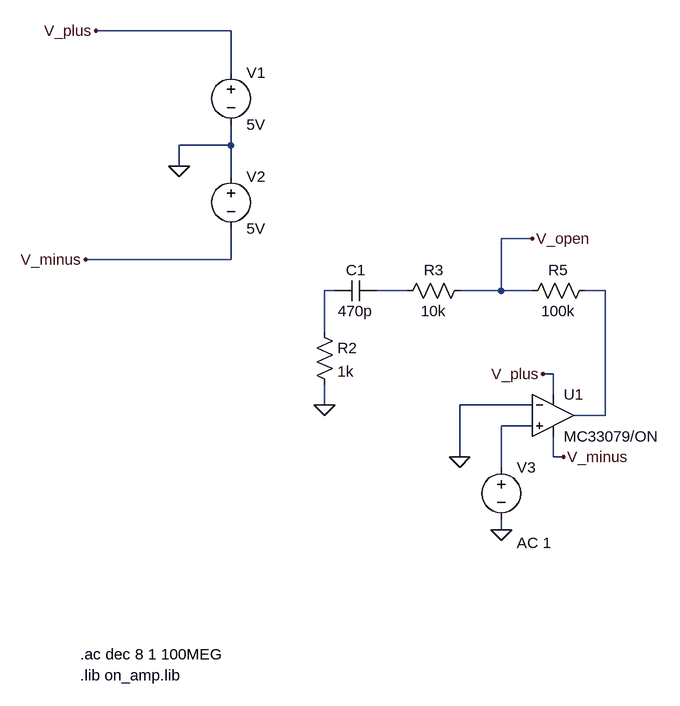
[diagram p0: schematic openloop_gain.asc]
openloop_gain.asc, the LTspice schematic file:
Version 4
SHEET 1 920 840
WIRE -1024 -448 -1232 -448
WIRE -1024 -384 -1024 -448
WIRE -1024 -272 -1024 -304
WIRE -1024 -272 -1104 -272
WIRE -1104 -240 -1104 -272
WIRE -1024 -224 -1024 -272
WIRE -560 -128 -608 -128
WIRE -1024 -96 -1024 -144
WIRE -1024 -96 -1248 -96
WIRE -864 -48 -880 -48
WIRE -752 -48 -800 -48
WIRE -608 -48 -608 -128
WIRE -608 -48 -672 -48
WIRE -560 -48 -608 -48
WIRE -448 -48 -480 -48
WIRE -880 16 -880 -48
WIRE -528 80 -544 80
WIRE -528 112 -528 80
WIRE -880 128 -880 96
WIRE -560 128 -672 128
WIRE -448 144 -448 -48
WIRE -448 144 -496 144
WIRE -560 160 -608 160
WIRE -672 208 -672 128
WIRE -528 208 -528 176
WIRE -512 208 -528 208
WIRE -608 224 -608 160
WIRE -608 320 -608 304
FLAG -1104 -240 0
FLAG -1232 -448 V_plus
FLAG -1248 -96 V_minus
FLAG -512 208 V_minus
FLAG -544 80 V_plus
FLAG -608 320 0
FLAG -672 208 0
FLAG -880 128 0
FLAG -560 -128 V_open
SYMBOL Opamps\\opamp2 -528 80 R0
SYMATTR InstName U1
SYMATTR Value MC33079/ON
SYMBOL voltage -1024 -400 R0
WINDOW 123 0 0 Left 0
WINDOW 39 0 0 Left 0
SYMATTR InstName V1
SYMATTR Value 5V
SYMBOL voltage -1024 -240 R0
WINDOW 123 0 0 Left 0
WINDOW 39 0 0 Left 0
SYMATTR InstName V2
SYMATTR Value 5V
SYMBOL voltage -608 208 R0
WINDOW 123 24 132 Left 0
WINDOW 39 0 0 Left 0
SYMATTR Value2 AC 1
SYMATTR InstName V3
SYMATTR Value ""
SYMBOL res -896 0 R0
SYMATTR InstName R2
SYMATTR Value 1k
SYMBOL cap -800 -64 R90
WINDOW 0 0 32 VBottom 0
WINDOW 3 32 32 VTop 0
SYMATTR InstName C1
SYMATTR Value 470p
SYMBOL res -656 -64 R90
WINDOW 0 0 56 VBottom 0
WINDOW 3 32 56 VTop 0
SYMATTR InstName R3
SYMATTR Value 10k
SYMBOL res -464 -64 R90
WINDOW 0 0 56 VBottom 0
WINDOW 3 32 56 VTop 0
SYMATTR InstName R5
SYMATTR Value 100k
TEXT -1256 544 Left 0 !.lib on_amp.lib
TEXT -1256 512 Left 0 !.ac dec 8 1 100MEG

The netlist it stands for:
* openloop_gain.asc
XU1 N004 0 V_plus V_minus N003 MC33079/ON  ; pins In+ In- V+ V- OUT
V1 V_plus 0 5V
V2 0 V_minus 5V
V3 N004 0 AC 1
R2 N001 0 1k
C1 N002 N001 470p
R3 V_open N002 10k
R5 N003 V_open 100k
.lib on_amp.lib
.ac dec 8 1 100MEG
.backanno
.end